# Altium schematic sheet STO.SchDoc
size 420 x 297 mm; SheetNumber: 5; SheetTotal: 7
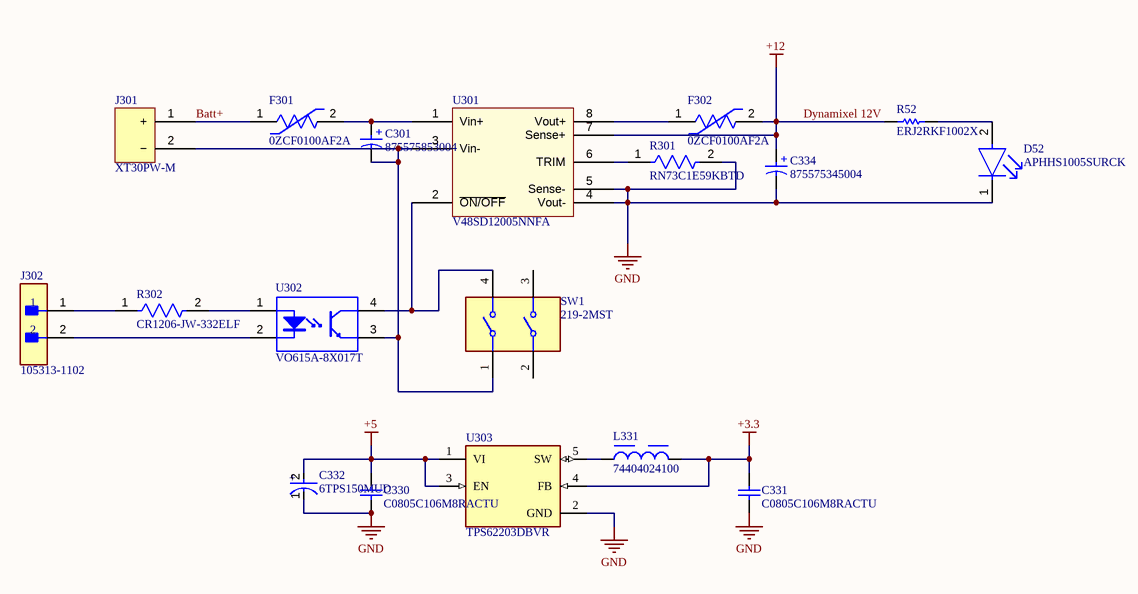
[diagram p0: STO.SchDoc]

## Parts
C301  875575853004  [WCAP-HSG5_D8H10.5]
C330  C0805C106M8RACTU  [CAPC2013X140X50NL20T25]
C331  C0805C106M8RACTU  [CAPC2013X140X50NL20T25]
C332  6TPS150MUD  [FP-POSCAP-B1S-MFG]
C334  875575345004  [WCAP-HSG5_D6.3H7.7]
D52  APHHS1005SURCK  [FP-APHHS1005SURCK-MFG]
F301  0ZCF0100AF2A  [FP-0ZCF0100AF2A-MFG]
F302  0ZCF0100AF2A  [FP-0ZCF0100AF2A-MFG]
J301  XT30PW-M  [XT30PW_M]
J302  105313-1102  [FP-105313-1102-MFG]
L331  74404024100  [WE-LQS_2512]
R52  ERJ2RKF1002X  [RESC1005X40X25LL05T05]
R301  RN73C1E59KBTD  [FP-RN731E-MFG]
R302  CR1206-JW-332ELF  [FP-CR1206-IPC_B]
SW1  219-2MST  [FP-219-2MST-MFG]
U301  V48SD12005NNFA  [1/16 Brick]
U302  VO615A-8X017T  [VISH-VO615A-XX017T_V]
U303  TPS62203DBVR  [FP-DBV0005A-IPC_B]

## Nets
+3.3: C331.2 L331.2 U303.4(FB)
+5: C330.1 C332.2(A) U303.1(VI) U303.3(EN)
Dynamixel 12V: C334.1(P) F302.2 R52.2 U301.7(Sense+)  [also labelled +12]
GND: C330.2 C331.1 C332.1(C) C334.2(N) D52.1(C) R301.2 U301.4(Vout-) U301.5(Sense-) U303.2(GND)
Batt+: F301.1 J301.1(+)
NetC301_1: C301.1(P) F301.2 U301.1(Vin+)
NetC301_2: C301.2(N) J301.2(−) SW1.1 U301.3(Vin-) U302.3(EMITTER)
NetD52_2: D52.2(A) R52.1
NetF302_1: F302.1 U301.8(Vout+)
NetJ302_1: J302.1 R302.1
NetJ302_2: J302.2 U302.2(CATHODE)
NetL331_1: L331.1 U303.5(SW)
NetR301_1: R301.1 U301.6(TRIM)
NetR302_2: R302.2 U302.1(ANODE)
NetSW1_4: SW1.4 U301.2(~{ON/OFF}) U302.4(COLLECTOR)

Not connected (* = marked no-connect by the designer): SW1 2 3

## Notes on the sheet
- CREATIVE COMMONS
- PUBLIC LICENSE:
- BARKOUR ROBOT
- CC BY-NC 4.0
- APPROVED
- DWG NO
- GOOGLE LLC
- FILE
- RELEASED
- 2024/05/09
- SIZE
- 1600 AMPHITHEATRE PARKWAY
- MOUNTAIN VIEW CA 94043
- A3
- SHEET
- OF
- THIS DESIGN IS BEING PROVIDED  FOR NON-COMMERCIAL USE ONLY. THE USE OF =SCIENTIST_NAME_POSSESSIVE NAME IN CONNECTION WITH THE DESIGN IS NOT INTENDED TO IMPLY THAT =SCIENTIST_NAME SPONSORS OR ENDORSES THE DESIGN, GOOGLE LLC, OR ANY OF GOOGLE LLC'S PRODUCTS OR SERVICES.
- (in symbol CMP-03913-134709149-1) +
- (in symbol CMP-03913-134709168-1) +
- (in symbol CMP-05428-000345-1) +

## Library data of the parts
C301 = CMP-03913-134709168-1: 875575853004 Cap, 47Uf, 63V, Alu Elec, Hybrid, Smd Rohs Compliant: Yes; ESR (Equivalent Series Resistance): 40mΩ; Ripple Current: 1.7A; Leakage Current: 29.6µA; Capacitance: 47µF; NexarPartId: 134709168; Diameter: 8mm; Length: 10.5mm; Max Operating Temperature: 105°C; RoHS: Compliant; Voltage Rating: 63V; Width: 8.3mm; Min Operating Temperature: -55°C
C330 C331 = CMP-2007-03245-1: Manufacturer: Kemet; Part Number: C0805C106M8RACTU
C332 = CMP-05428-000345-1: Molded Tantalum Polymer Capacitor 150uF 20% 6.3V life 2000Hours SMD 1411; RoHS Compliant: Yes
C334 = CMP-03913-134709149-1: 875575345004 Cap, 220Uf, 16V, Alu Elec, Hybrid, Smd Rohs Compliant: Yes; Ripple Current: 2A; Leakage Current: 35.2µA; ESR (Equivalent Series Resistance): 30mΩ; Capacitance: 220µF; NexarPartId: 134709149; Max Operating Temperature: 105°C; Voltage Rating: 16V; Diameter: 6.3mm; RoHS: Compliant; Min Operating Temperature: -55°C; Width: 6.5mm; Length: 7.7mm
D52 = CMP-2000-05787-2: LED RED CLEAR CHIP SMD; Forward Current: 20mA; Number of LEDs: 1; Dominant Wavelength: 630nm; Luminous Intensity: 220mcd; Wavelength: 635nm; Forward Voltage: 1.95V; Viewing Angle: 120°; Case/Package: 0402; Length: 1mm; Packaging: Tape and Reel; Lens Color: Clear; Width: 0.5mm; Test Current: 20mA; Lead Free: Lead Free; Min Operating Temperature: -40°C; Illumination Color: Red; Max Operating Temperature: 85°C; Mount: Surface Mount; Package Quantity: 2000; Lens Style: Clear; Case Code (Imperial): 0402; Height: 0.6mm; Number of Pins: 2; Case Code (Metric): 1005; Color: Red
F301 F302 = CMP-16043-000014-1: PTC RESET FUSE 60V 1A 2920; Trip Current: 2A; Time to Trip: 0.5s; Max Current Rating: 100A; Case Code (Imperial): 2920; Thickness: 0.067inch; Case Code (Metric): 7351; Hold Current: 1A; Packaging: Tape and Reel; Length: 0.29inch; Width: 0.202inch; RoHS Compliant: Yes; Mount: Surface Mount
J301 = XT30PW-M: Amass XT30 RA TH male header; Manufacturer: Amass; Manufacturer Part Number: XT30PW-M
J302 = CMP-04776-000341-1: CONN HEADER R/A 2POS 2.5MM
L331 = CMP-1354-00007-2: NexarPartId: 46948232; Self Resonant Frequency: 30MHz; Max DC Current: 470mA; Inductance Tolerance: 20%; Core Material: Ferrite; Saturation Current: 850mA; DC Resistance (DCR): 430mΩ; Shielding: Shielded; Current Rating: 650mA; Inductance: 10µH; Test Frequency: 1MHz; Composition: Wirewound; Mount: Surface Mount; Ambient Temperature Range High: 85°C; Height: 1.2mm; Height - Seated (Max): 1.1938mm; Packaging: Tape & Reel (TR); Ambient Temperature Range Low: -40°C; RoHS: Compliant; Weight: 32.006612mg; Termination: SMD/SMT; Max Operating Temperature: 125°C; Min Operating Temperature: -40°C; Width: 2mm; RMS Current (Irms): 470mA; Case/Package: Nonstandard; REACH SVHC: Unknown; Length: 2.5mm; Tolerance: 20%
R52 = CMP-2000-07588-1: Chip Resistor, 10 KOhm, +/- 1%, 0.1 W, -55 to 155 degC, 0402 (1005 Metric), RoHS, Tape and Reel; Manufacturer: Panasonic; Power Rating: 100mW; Voltage Rating: 50V; Resistance: 10KOhm; Case\/Package: 0402; Temperature Coefficient: 100ppm\/degreesC; RoHSCompliant: True; Lead Free: LeadFree; Package Quantity: 1; Contact Plating: Tin; Length: 1mm; Radiation Hardening: No; REACH SVHC: NoSVHC; Max Operating Temperature: 155degC; Depth: 0.5mm; Case Code (Imperial): 0402; Military Standard: Not; Package Description: 2-Pin Surface Mount Device, Body 1 x 0.5 mm; Termination: SMD/SMT; Case Code (Metric): 1005; Height: 0.35mm; Packaging: TapeandReel; Voltage Rating (DC): 50V; Package Reference: 402; Number of Pins: 2; Tolerance: 1%; Mounting Technology: SurfaceMount; Width: 0.02inch; Mount: SurfaceMount; Datasheet URL: https://industrial.panasonic.com/cdbs/www-data/pdf/RDA0000/AOA0000C304.pdf; Composition: ThickFilm; Datasheet Version: 02/2017; Manufacturer URL: http://www.panasonic.com/; Max Power Dissipation: 100mW; Number of Terminations: 2; Min Operating Temperature: -55degC
R301 = CMP-03211-010675-1: Res Thin Film 0402 59KΩ 0.1% 1/16W 10ppm/°C Molded SMD; Manufacturer: TE Connectivity; Voltage Rating: 25V; Power Rating: 0.063W; Temperature: -55°C to +155°C; Temperature Range Low: -55°C; ComponentLink2URL: https://www.te.com/commerce/DocumentDelivery/DDEController?Action=showdoc&DocId=Data+Sheet%7F1773270%7FP%7Fpdf%7FEnglish%7FENG_DS_1773270_P.pdf%7F1-1879132-6; Octopart: https://octopart.com/rn73c1e59kbtd-te+connectivity-76703336; Manufacturer Part Number: RN73C1E59KBTD; packaging: 5000 Reel; Lead Free: Yes; Ipc Land Pattern Name: RESC10050X30; Temperature Range High: +155°C; Device Class L1: Passive Components; octopart_url: https://octopart.com/rn73c1e59kbtd-te+connectivity-76703336; Resistance: 59KΩ; Height: 0.35mm; Value: 59KΩ; Device Class L2: Resistors; Tolerance: 0.1%; Category: Res; Package: RN731E; RoHS: TRUE; Series: RN73; Temperature Coefficient: 10ppm/°C; Automotive: No; Device Class L3: Chip SMD Resistors; ComponentLink2Description: Datasheet; Composition: Thin Film
R302 = CMP-07231-005113-1: Thick Film Chip Resistors 1206 3.3kΩ 0.25W 5% 200ppm/°C; Power Rating: 250mW; Resistance: 3.3kR; Voltage Rating: 200V; Contact Plating: Tin; Depth: 1.6mm; Mount: Surface Mount; Width: 1.6mm; Number of Terminations: 2; Military Standard: Not; Length: 3.2mm; Features: Moisture Resistant; Radiation Hardening: No; Package Quantity: 5000; Case/Package: 1206; Case Code (Imperial): 1206; Packaging: Tape and Reel; Case Code (Metric): 3216; Thickness: 610um; Composition: Thick Film; Max Operating Temperature: 155°C; Max Power Dissipation: 250mW; Temperature Coefficient: 200ppm/°C; Tolerance: 5%; Min Operating Temperature: -55°C; Height: 0.03inch; Termination: SMD/SMT
SW1 = CMP-07018-000006-1: SWITCH SLIDE DIP SPST 100MA 20V; Mechanical Life: 2000Cycles; Number of Positions: 2; Actuator Type: Slide (Standard); Contact Resistance: 25mR; Actuator Length: 0.25mm; Pitch: 0.1inch; Washable: Yes; Length: 0.258inch; Orientation: Straight; Package Quantity: 85; Mount: Surface Mount; Contact Plating: Gold; Packaging: Rail/Tube; RoHS Compliant: Yes; Max Current Rating: 100mA; Throw Configuration: SPST; Terminal Pitch: 2.54mm; Depth: 9.91mm; Radiation Hardening: No; Contact Material: Copper; Voltage Rating (DC): 20V; Max Operating Temperature: 85°C; Termination: Gull Wing; Max Voltage Rating (DC): 20V; Current Rating: 100mA; Electrical Life: 2000Cycles; Height: 4.05mm; Min Operating Temperature: -55°C
U302 = CMP-2000-07399-1: Optocoupler, Phototransistor Output, High Temperature, 5000 VRMS, -55 to 110 degC, 4-Pin SMD, RoHS, Tape and Reel; Manufacturer: Vishay; Vce Saturation (Max): 300mV; Turn On / Turn Off Time (Typ): 6µs,5µs; Minimum Quantity: 1; Other Names: VO615A-8X017TDKR; Current - Output / Channel: 50mA; Current - DC Forward (If): 60mA; Voltage - Forward (Vf) (Typ): 1.43V; Current Transfer Ratio (Max): 260%@5mA; Input Type: DC; Dynamic Catalog: VOS615A,VOS617A,VOS618ASeries; Rise / Fall Time (Typ): 3µs,4.7µs; Current Transfer Ratio (Min): 130%@5mA; Voltage - Output (Max): 70V; Packaging: Digi-Reel®; Package Description: 4-Pin Surface Mount Device, Body 6.5 x 4.58 mm, Pitch 2.54 mm; Voltage - Isolation: 5000Vrms; Standard Package: 1; Category: Isolators; Output Type: Transistor; Datasheet URL: http://www.vishay.com/docs/81753/vo615a.pdf; Manufacturer URL: http://www.vishay.com/; Quantity Available: Tape&Reel(TR)AlternatePackaging; Package/Case: 4-SMD,GullWing; Operating Temperature: -55°C~110°C; Supplier Device Package: 4-SMD; Family: Optoisolators-Transistor,PhotovoltaicOutput; Current - DC Forward (If) (Max): 60mA; Package Reference: VO615A-XX017T; Datasheet Version: Rev. 2.2, 09/2013; Package / Case: 4-SMD,GullWing; Mounting Type: SurfaceMount; Mounting Technology: SurfaceMount; Number of Channels: 1; Voltage - Output: 70V
U303 = CMP-04918-000656-1: IC REG BUCK 3.3V 300MA SOT23-5; Number of Outputs: 1; Nominal Supply Current: 15uA; Operating Supply Voltage: 6V; Min Input Voltage: 2.5V; Efficiency: 95%; Synchronous Rectifier: Yes; Output Type: Fixed; Switching Frequency: 1MHz; Output Configuration: Positive; Number of Pins: 5; Max Operating Temperature: 85°C; Output Voltage: 3.3V; Lead Free: Lead Free; Package Quantity: 3000; Output Current: 300mA; Min Output Voltage: 3.3V; Min Operating Temperature: -40°C; Packaging: Tape and Reel; Max Output Current: 300mA; Min Supply Voltage: 2.5V; RoHS Compliant: Yes; Supply Current: 15uA; Radiation Hardening: No; Quiescent Current: 15uA; Series: -; Contact Plating: Gold; Mount: Surface Mount; Case/Package: SOT-23-5; Max Input Voltage: 6V